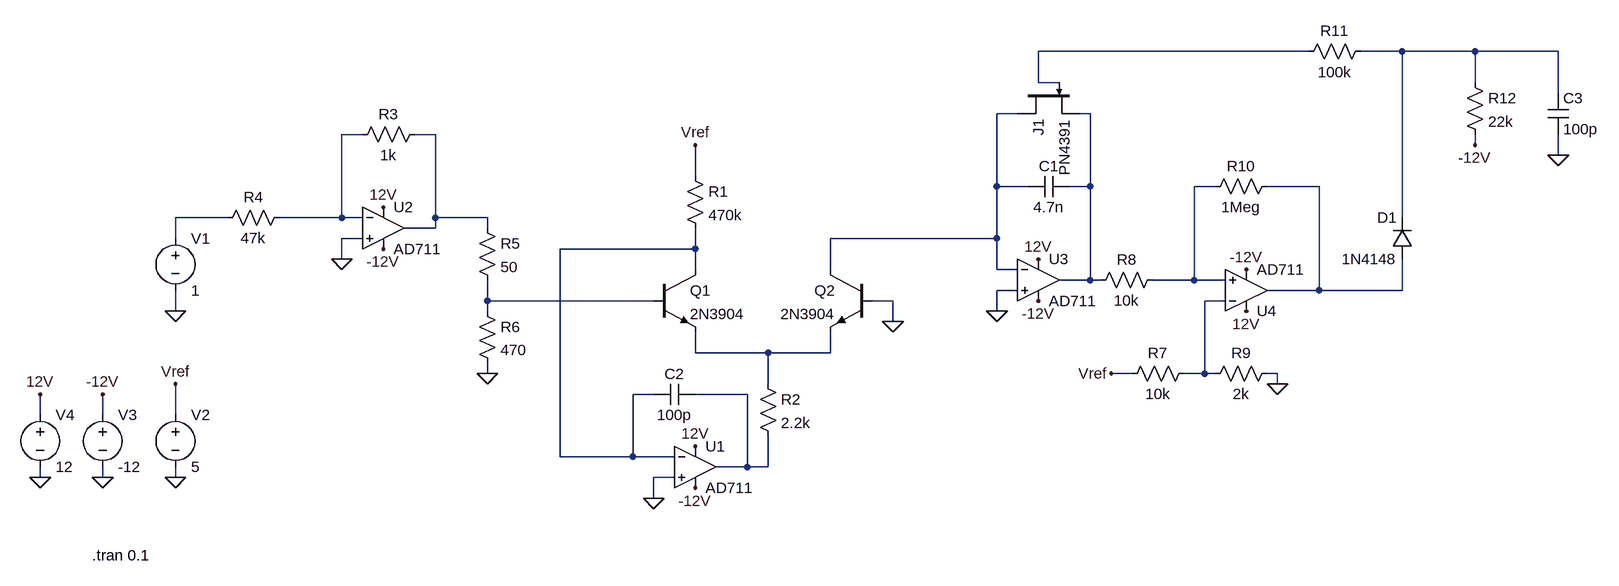
[diagram p0: schematic Draft2.asc]
Draft2.asc, the LTspice schematic file:
Version 4.1
SHEET 1 1592 680
WIRE 1136 -224 720 -224
WIRE 1280 -224 1216 -224
WIRE 1392 -224 1280 -224
WIRE 1520 -224 1392 -224
WIRE 720 -176 720 -224
WIRE 752 -176 720 -176
WIRE 1392 -176 1392 -224
WIRE 1520 -160 1520 -224
WIRE 688 -128 656 -128
WIRE 800 -128 784 -128
WIRE -320 -96 -352 -96
WIRE -208 -96 -240 -96
WIRE 1392 -80 1392 -96
WIRE 1520 -64 1520 -96
WIRE 192 -32 192 -80
WIRE 656 -16 656 -128
WIRE 704 -16 656 -16
WIRE 800 -16 800 -128
WIRE 800 -16 768 -16
WIRE 992 -16 960 -16
WIRE 1152 -16 1072 -16
WIRE -528 32 -608 32
WIRE -352 32 -352 -96
WIRE -352 32 -448 32
WIRE -320 32 -352 32
WIRE -208 32 -208 -96
WIRE -128 32 -208 32
WIRE 1280 32 1280 -224
WIRE -208 48 -208 32
WIRE -208 48 -256 48
WIRE -128 48 -128 32
WIRE -608 64 -608 32
WIRE -320 64 -352 64
WIRE 656 64 656 -16
WIRE 656 64 400 64
WIRE 192 80 192 48
WIRE 192 80 -16 80
WIRE -352 96 -352 64
WIRE 192 112 192 80
WIRE 400 112 400 64
WIRE 656 112 656 64
WIRE 688 112 656 112
WIRE 800 128 800 -16
WIRE 800 128 752 128
WIRE 816 128 800 128
WIRE 960 128 960 -16
WIRE 960 128 896 128
WIRE 1008 128 960 128
WIRE 688 144 656 144
WIRE 1152 144 1152 -16
WIRE 1152 144 1072 144
WIRE 1280 144 1280 96
WIRE 1280 144 1152 144
WIRE -128 160 -128 128
WIRE 128 160 -128 160
WIRE 496 160 464 160
WIRE 1008 160 976 160
WIRE -608 176 -608 144
WIRE -128 176 -128 160
WIRE 656 176 656 144
WIRE 496 192 496 160
WIRE 192 240 192 208
WIRE 304 240 192 240
WIRE 400 240 400 208
WIRE 400 240 304 240
WIRE -128 272 -128 256
WIRE 864 272 832 272
WIRE 976 272 976 160
WIRE 976 272 944 272
WIRE 992 272 976 272
WIRE 1088 272 1072 272
WIRE 304 288 304 240
WIRE 1088 288 1088 272
WIRE 128 304 96 304
WIRE 272 304 192 304
WIRE -816 336 -816 304
WIRE -720 336 -720 304
WIRE -608 336 -608 288
WIRE -16 400 -16 80
WIRE 96 400 96 304
WIRE 96 400 -16 400
WIRE 160 400 96 400
WIRE 272 416 272 304
WIRE 272 416 224 416
WIRE 304 416 304 368
WIRE 304 416 272 416
WIRE -816 432 -816 416
WIRE -720 432 -720 416
WIRE -608 432 -608 416
WIRE 160 432 128 432
WIRE 128 464 128 432
FLAG 496 192 0
FLAG -608 432 0
FLAG -608 288 Vref
FLAG 192 -80 Vref
FLAG -816 432 0
FLAG -720 432 0
FLAG -816 304 12V
FLAG -720 304 -12V
FLAG 192 448 -12V
FLAG 192 384 12V
FLAG 128 464 0
FLAG -288 80 -12V
FLAG -288 16 12V
FLAG -352 96 0
FLAG -128 272 0
FLAG -608 176 0
FLAG 720 160 -12V
FLAG 720 96 12V
FLAG 656 176 0
FLAG 1040 112 -12V
FLAG 1040 176 12V
FLAG 832 272 Vref
FLAG 1088 288 0
FLAG 1392 -80 -12V
FLAG 1520 -64 0
SYMBOL npn 128 112 R0
SYMATTR InstName Q1
SYMATTR Value 2N3904
SYMBOL npn 464 112 M0
SYMATTR InstName Q2
SYMATTR Value 2N3904
SYMBOL res 176 -48 R0
SYMATTR InstName R1
SYMATTR Value 470k
SYMBOL voltage -608 320 R0
WINDOW 123 0 0 Left 0
WINDOW 39 0 0 Left 0
SYMATTR InstName V2
SYMATTR Value 5
SYMBOL OpAmps\\AD711 192 352 R0
SYMATTR InstName U1
SYMBOL voltage -720 320 R0
WINDOW 123 0 0 Left 0
WINDOW 39 0 0 Left 0
SYMATTR InstName V3
SYMATTR Value -12
SYMBOL voltage -816 320 R0
WINDOW 123 0 0 Left 0
WINDOW 39 0 0 Left 0
SYMATTR InstName V4
SYMATTR Value 12
SYMBOL res 288 272 R0
SYMATTR InstName R2
SYMATTR Value 2.2k
SYMBOL OpAmps\\AD711 -288 -16 R0
SYMATTR InstName U2
SYMBOL res -224 -112 R90
WINDOW 0 0 56 VBottom 2
WINDOW 3 32 56 VTop 2
SYMATTR InstName R3
SYMATTR Value 1k
SYMBOL res -432 16 R90
WINDOW 0 0 56 VBottom 2
WINDOW 3 32 56 VTop 2
SYMATTR InstName R4
SYMATTR Value 47k
SYMBOL res -144 32 R0
SYMATTR InstName R5
SYMATTR Value 50
SYMBOL res -144 160 R0
SYMATTR InstName R6
SYMATTR Value 470
SYMBOL voltage -608 48 R0
WINDOW 123 0 0 Left 0
WINDOW 39 0 0 Left 0
SYMATTR InstName V1
SYMATTR Value 1
SYMBOL OpAmps\\AD711 720 64 R0
SYMATTR InstName U3
SYMBOL cap 192 288 R90
WINDOW 0 0 32 VBottom 2
WINDOW 3 32 32 VTop 2
SYMATTR InstName C2
SYMATTR Value 100p
SYMBOL OpAmps\\AD711 1040 208 M180
SYMATTR InstName U4
SYMBOL res 960 256 R90
WINDOW 0 0 56 VBottom 2
WINDOW 3 32 56 VTop 2
SYMATTR InstName R7
SYMATTR Value 10k
SYMBOL res 1088 256 R90
WINDOW 0 0 56 VBottom 2
WINDOW 3 32 56 VTop 2
SYMATTR InstName R9
SYMATTR Value 2k
SYMBOL cap 768 -32 R90
WINDOW 0 0 32 VBottom 2
WINDOW 3 32 32 VTop 2
SYMATTR InstName C1
SYMATTR Value 4.7n
SYMBOL diode 1296 96 R180
WINDOW 0 24 64 Left 2
WINDOW 3 24 0 Left 2
SYMATTR InstName D1
SYMATTR Value 1N4148
SYMBOL njf 688 -176 M90
SYMATTR InstName J1
SYMATTR Value PN4391
SYMBOL res 912 112 R90
WINDOW 0 0 56 VBottom 2
WINDOW 3 32 56 VTop 2
SYMATTR InstName R8
SYMATTR Value 10k
SYMBOL res 1088 -32 R90
WINDOW 0 0 56 VBottom 2
WINDOW 3 32 56 VTop 2
SYMATTR InstName R10
SYMATTR Value 1Meg
SYMBOL res 1232 -240 R90
WINDOW 0 0 56 VBottom 2
WINDOW 3 32 56 VTop 2
SYMATTR InstName R11
SYMATTR Value 100k
SYMBOL res 1376 -192 R0
SYMATTR InstName R12
SYMATTR Value 22k
SYMBOL cap 1504 -160 R0
SYMATTR InstName C3
SYMATTR Value 100p
TEXT -736 552 Left 2 !.tran 0.1

The netlist it stands for:
* Draft2.asc
Q1 N010 N011 N013 0 2N3904
Q2 N003 0 N013 0 2N3904
R1 Vref N010 470k
V2 Vref 0 5
X§U1 0 N010 12V -12V N014 AD712  ; AD711, pins In+ In- V+ V- OUT
V3 -12V 0 -12
V4 12V 0 12
R2 N013 N014 2.2k
X§U2 0 N005 12V -12V N006 AD712  ; AD711, pins In+ In- V+ V- OUT
R3 N006 N005 1k
R4 N005 N009 47k
R5 N006 N011 50
R6 N011 0 470
V1 N009 0 1
X§U3 0 N003 12V -12V N004 AD712  ; AD711, pins In+ In- V+ V- OUT
C2 N014 N010 100p
X§U4 N007 N012 12V -12V N008 AD712  ; AD711, pins In+ In- V+ V- OUT
R7 N012 Vref 10k
R9 0 N012 2k
C1 N004 N003 4.7n
D1 N008 N002 1N4148
J1 N003 N001 N004 PN4391
R8 N007 N004 10k
R10 N008 N007 1Meg
R11 N002 N001 100k
R12 N002 -12V 22k
C3 N002 0 100p
.model D D
.lib standard.dio
.model NPN NPN
.model PNP PNP
.lib standard.bjt
.model NJF NJF
.model PJF PJF
.lib standard.jft
.tran 0.1
.lib ADI1.lib
.backanno
.end